# EAGLE design Wattuino-Pro-Mini-PB_v10 (EAGLE 7.5.0)
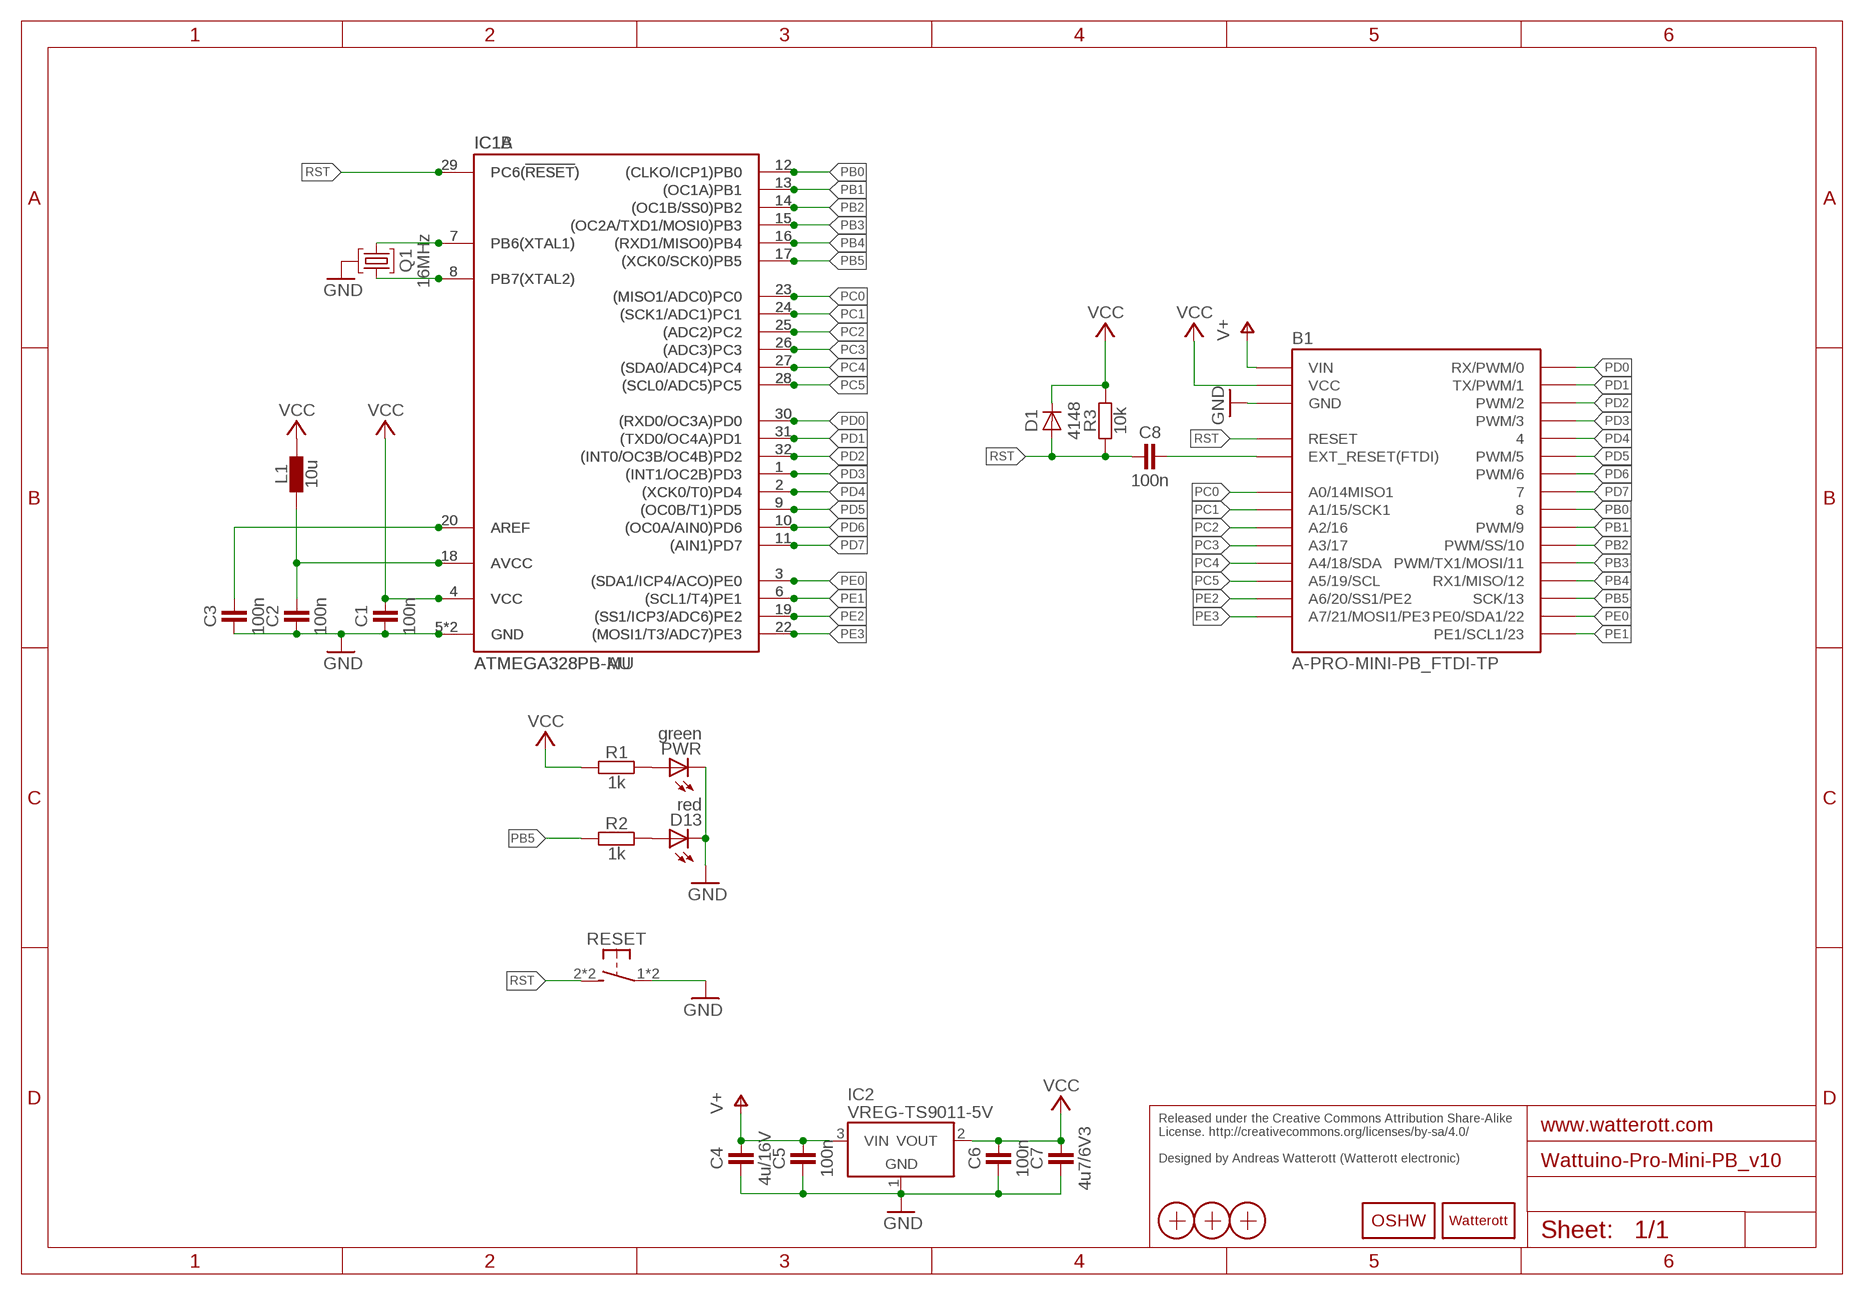
[diagram p0: schematic, sheet 1]

## Parts
B1  A-PRO-MINI-PB_FTDI-TP  [A-PRO-MINI-PB-FTDI_TP]
C1  100n  CAPACITOR-0402  [C0402]
C2  100n  CAPACITOR-0402  [C0402]
C3  100n  CAPACITOR-0402  [C0402]
C4  4u/16V  CAPACITOR-0805  [C0805]
C5  100n  CAPACITOR-0402  [C0402]
C6  100n  CAPACITOR-0402  [C0402]
C7  4u7/6V3  CAPACITOR-0402  [C0402]
C8  100n  CAPACITOR-0402  [C0402]
D1  4148  DIODE-SOD882  [SOD882]
D13  red  LED-0603  [C0603]
IC1A  ATMEGA328PB-AU  [TQFP32]
IC1B  ATMEGA328PB-MU  [QFN32-PAD]
IC2  VREG-TS9011-5V  [SOT23]
L1  10u  INDUCTOR-0603  [C0603]
LOGO1  OSHW_LOGOX0070  [OSHW_6X70]
LOGO2  LOGO-S_PLACE_S  [SPARK_TPLACE_S]
PWR  green  LED-0603  [C0603]
Q1  16MHz  CRYSTAL-RES-32  [CRYSTAL_32X13]
R1  1k  RESISTOR-0402  [C0402]
R2  1k  RESISTOR-0402  [C0402]
R3  10k  RESISTOR-0402  [C0402]
RESET  SW-TACTILE-TL3315  [TL3315N]
X1  PASSER-07  [PASSER_07MM]
X2  PASSER-07  [PASSER_07MM]
X3  PASSER-07  [PASSER_07MM]

## Nets
AREF: C3.2 IC1A.20(AREF) IC1B.20(AREF)
AVCC: C2.2 IC1A.18(AVCC) IC1B.18(AVCC) L1.1
GND: B1.GND@1(GND) B1.GND@2(GND) B1.GND@3(GND) B1.GND@4(GND) C1.1 C2.1 C3.1 C4.1 C5.1 C6.1 C7.1 D13.C IC1A.5(GND) IC1A.21(GND) IC1B.5(GND) IC1B.21(GND) IC2.1(GND) PWR.C Q1.GND RESET.1 RESET.4(P1)
N$3: IC1A.8(PB7(XTAL2)) IC1B.8(PB7(XTAL2)) Q1.1
N$4: IC1A.7(PB6(XTAL1)) IC1B.7(PB6(XTAL1)) Q1.2
N$8: PWR.A R1.2
N$9: D13.A R2.2
N$11: B1.EXT_RST(EXT_RESET(FTDI)) C8.2
PB0: B1.8 IC1A.12((CLKO/ICP1)PB0) IC1B.12((CLKO/ICP1)PB0)
PB1: B1.9(PWM/9) IC1A.13((OC1A)PB1) IC1B.13((OC1A)PB1)
PB2: B1.10(PWM/SS/10) IC1A.14((OC1B/SS0)PB2) IC1B.14((OC1B/SS0)PB2)
PB3: B1.11(PWM/TX1/MOSI/11) IC1A.15((OC2A/TXD1/MOSI0)PB3) IC1B.15((OC2A/TXD1/MOSI0)PB3)
PB4: B1.12(RX1/MISO/12) IC1A.16((RXD1/MISO0)PB4) IC1B.16((RXD1/MISO0)PB4)
PB5: B1.13(SCK/13) IC1A.17((XCK0/SCK0)PB5) IC1B.17((XCK0/SCK0)PB5) R2.1
PC0: B1.A0(A0/14MISO1) IC1A.23((MISO1/ADC0)PC0) IC1B.23((MISO1/ADC0)PC0)
PC1: B1.A1(A1/15/SCK1) IC1A.24((SCK1/ADC1)PC1) IC1B.24((SCK1/ADC1)PC1)
PC2: B1.A2(A2/16) IC1A.25((ADC2)PC2) IC1B.25((ADC2)PC2)
PC3: B1.A3(A3/17) IC1A.26((ADC3)PC3) IC1B.26((ADC3)PC3)
PC4: B1.A4(A4/18/SDA) IC1A.27((SDA0/ADC4)PC4) IC1B.27((SDA0/ADC4)PC4)
PC5: B1.A5(A5/19/SCL) IC1A.28((SCL0/ADC5)PC5) IC1B.28((SCL0/ADC5)PC5)
PD0: B1.RXD@1(RX/PWM/0) B1.RXD@2(RX/PWM/0) IC1A.30((RXD0/OC3A)PD0) IC1B.30((RXD0/OC3A)PD0)
PD1: B1.TXD@1(TX/PWM/1) B1.TXD@2(TX/PWM/1) IC1A.31((TXD0/OC4A)PD1) IC1B.31((TXD0/OC4A)PD1)
PD2: B1.2(PWM/2) IC1A.32((INT0/OC3B/OC4B)PD2) IC1B.32((INT0/OC3B/OC4B)PD2)
PD3: B1.3(PWM/3) IC1A.1((INT1/OC2B)PD3) IC1B.1((INT1/OC2B)PD3)
PD4: B1.4 IC1A.2((XCK0/T0)PD4) IC1B.2((XCK0/T0)PD4)
PD5: B1.5(PWM/5) IC1A.9((OC0B/T1)PD5) IC1B.9((OC0B/T1)PD5)
PD6: B1.6(PWM/6) IC1A.10((OC0A/AIN0)PD6) IC1B.10((OC0A/AIN0)PD6)
PD7: B1.7 IC1A.11((AIN1)PD7) IC1B.11((AIN1)PD7)
PE0: B1.PE0(PE0/SDA1/22) IC1A.3((SDA1/ICP4/ACO)PE0) IC1B.3((SDA1/ICP4/ACO)PE0)
PE1: B1.PE1(PE1/SCL1/23) IC1A.6((SCL1/T4)PE1) IC1B.6((SCL1/T4)PE1)
PE2: B1.A6(A6/20/SS1/PE2) IC1A.19((SS1/ICP3/ADC6)PE2) IC1B.19((SS1/ICP3/ADC6)PE2)
PE3: B1.A7(A7/21/MOSI1/PE3) IC1A.22((MOSI1/T3/ADC7)PE3) IC1B.22((MOSI1/T3/ADC7)PE3)
RST: B1.RST@1(RESET) B1.RST@2(RESET) C8.1 D1.A IC1A.29(PC6(!RESET!)) IC1B.29(PC6(!RESET!)) R3.1 RESET.2(S1) RESET.3(S1)
V+: B1.VIN C4.2 C5.2 IC2.3(VIN)
VCC: B1.VCC@1(VCC) B1.VCC@2(VCC) C1.2 C6.2 C7.2 D1.C IC1A.4(VCC) IC1B.4(VCC) IC2.2(VOUT) L1.2 R1.1 R3.2

## Notes on the sheet
- Released under the Creative Commons Attribution Share-Alike 
  License. http://creativecommons.org/licenses/by-sa/4.0/
  
  Designed by Andreas Watterott (Watterott electronic)

## Library data of the parts
B1 = we-board:A-PRO-MINI-PB_FTDI: Wattuino Pro Mini PB with FTDI connector (Arduino Pro Mini Clone)
C1-C8 = we-rcl:CAPACITOR: Capacitors ...4.7uF @ 6.3V -> 0402 ...10uF @ 16V -> 0603 ...22uF @ 25V -> 0805
D1 = we-rcl:DIODE: Diodes
D13 PWR = we-opto:LED: LEDs red, green, blue -> 0603
IC1A IC1B = we-chip:ATMEGA328PB: Atmel ATmeg328PB AVR Microcontroller
IC2 = we-power:VREG: Voltage Regulators (LDOs, Switching Converters...) LDOs Taiwan Semi TS1117 800mA max 15V - compatible On Semi NCP1117 1A max 20V Taiwan Semi TS9011 250mA max 12V - compatible Diodes AP2210 300mA max 15V - compatible Microchip MCP1702 250mA max 13V - compatible Microchip MCP1703 250mA max 16V - compatible Microchip MCP1754 150mA max 16V Taiwan Semi TS5204 150mA max 16V (low noise) DC/DC Converter Modules Recom R-78Ex.x-1.0-W36 1A max 28V Murata OKI-78SR-x.x/1.5-W36 1.5A max 36V
L1 = we-rcl:INDUCTOR: Inductors Ferrite Bead 0603 1.4A 220Ohm @ 100MH, -> Murata BLM18PG221SH1D 0603 1.0A 20Ohm @ 100MH -> Murata BLM18PG300SN1D
LOGO1 = we-symbol:OSHW_LOGO: Open-Source-Hardware Logo
LOGO2 = we-symbol:LOGO: Watterott electronic Logo
Q1 = we-rcl:CRYSTAL-RES: Crystal Resonators 8MHz and 16MHz -> 32x13
R1-R3 = we-rcl:RESISTOR: Resistors all kinds in 0603 and 0402
RESET = we-switch:SW-TACTILE: Tactile Switches; DIGIKEY: EG4621TR-ND
X1-X3 = we-symbol:PASSER: Fiducial Markers

## Board
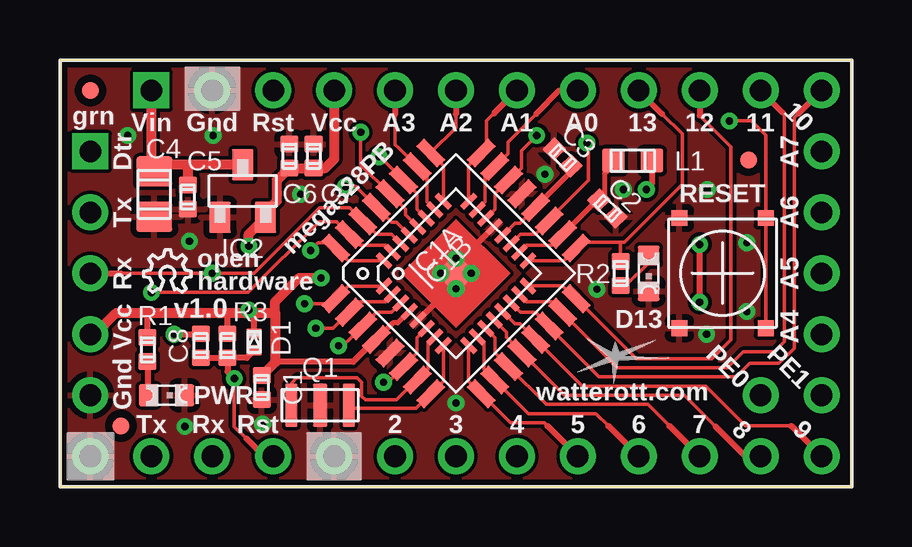
[diagram p1: board, top side]
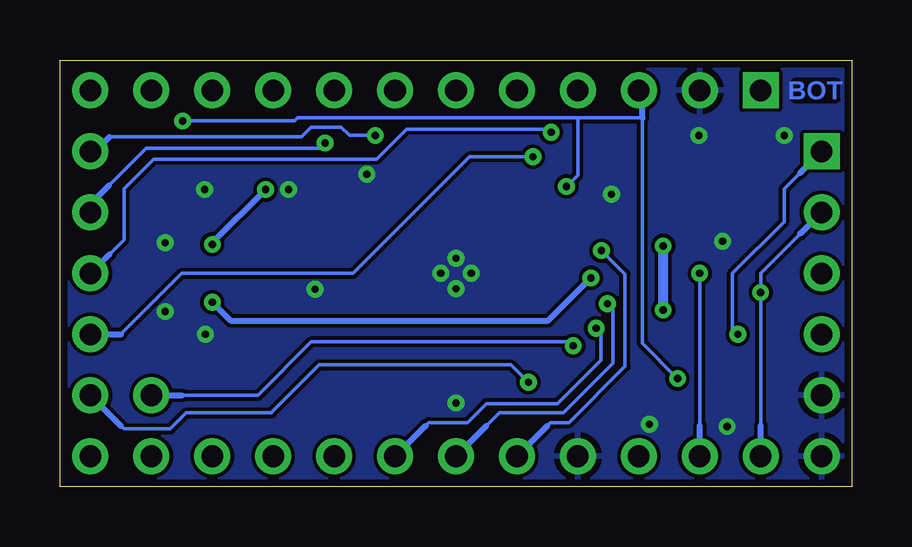
[diagram p2: board, bottom side, seen from below]

Size 33.02 x 17.78 mm. Coordinates in mm from the lower left corner, seen from the top.
Outline: 0,0 33.02,0 33.02,17.78 0,17.78 0,0
Copper layers (1*16): Top 0.035mm / dielectric 1.5mm / Bottom 0.035mm
Design rules "we-dru *": minimum track width 0.15mm, minimum drill 0.3mm, track to track 0.15mm, track to pad 0.15mm, pad to pad 0.15mm, via to via 0.15mm, smd to smd 0.1mm, copper to edge 0.3mm, drill to drill 0.2mm, minimum pad ring 0.18mm, minimum via ring 0.2mm, stop-mask expansion 0.1mm, vias tented up to drill 0.5mm, thermal gap 0.25mm

### Footprints (pad centres in the part's own frame; a part is rotated, then mirrored left to right if it is on the bottom)
A-PRO-MINI-PB-FTDI_TP = drill 0.9 pad 1.5: 2 -2.54,-7.62; 3 0,-7.62; 4 2.54,-7.62; 5 5.08,-7.62; 6 7.62,-7.62; 7 10.16,-7.62; 8 12.7,-7.62; 9 15.24,-7.62; 10 15.24,7.62; 11 12.7,7.62; 12 10.16,7.62; 13 7.62,7.62; A0 5.08,7.62; A1 2.54,7.62; A2 0,7.62; A3 -2.54,7.62; A4 15.24,-2.54; A5 15.24,0; A6 15.24,2.54; A7 15.24,5.08; GND@1 -10.16,7.62; GND@2 -5.08,-7.62; GND@3 -15.24,-7.62; GND@4 -15.24,-5.08; PE0 12.7,-5.08; PE1 15.24,-5.08; RST@1 -7.62,7.62; RST@2 -7.62,-7.62; RXD@1 -10.16,-7.62; RXD@2 -15.24,0; TXD@1 -12.7,-7.62; TXD@2 -15.24,2.54; VCC@1 -5.08,7.62; VCC@2 -15.24,-2.54 | drill 0.9 pad 1.5 square: EXT_RST -15.24,5.08; VIN -12.7,7.62
C0402 = smd 0.75 x 0.7: 1 0,0.5; 2 0,-0.5
C0805 = smd 1.5 x 1.25: 1 0,0.95; 2 0,-0.95
SOD882 = smd 0.65 x 0.4: A 0,-0.35; C 0,0.35
C0603 = smd 0.9 x 0.8: A 0,-0.75; C 0,0.75
TQFP32 = smd 1.27 x 0.5: 1 -4.293,2.8; 2 -4.293,2; 3 -4.293,1.2; 4 -4.293,0.4; 5 -4.293,-0.4; 6 -4.293,-1.2; 7 -4.293,-2; 8 -4.293,-2.8; 17 4.293,-2.8; 18 4.293,-2; 19 4.293,-1.2; 20 4.293,-0.4; 21 4.293,0.4; 22 4.293,1.2; 23 4.293,2; 24 4.293,2.8 | smd 0.5 x 1.27: 9 -2.8,-4.293; 10 -2,-4.293; 11 -1.2,-4.293; 12 -0.4,-4.293; 13 0.4,-4.293; 14 1.2,-4.293; 15 2,-4.293; 16 2.8,-4.293; 25 2.8,4.293; 26 2,4.293; 27 1.2,4.293; 28 0.4,4.293; 29 -0.4,4.293; 30 -1.2,4.293; 31 -2,4.293; 32 -2.8,4.293
QFN32-PAD = smd 0.8 x 0.26: 1 -2.5,1.75; 2 -2.5,1.25; 3 -2.5,0.75; 4 -2.5,0.25; 5 -2.5,-0.25; 6 -2.5,-0.75; 7 -2.5,-1.25; 8 -2.5,-1.75; 17 2.5,-1.75; 18 2.5,-1.25; 19 2.5,-0.75; 20 2.5,-0.25; 21 2.5,0.25; 22 2.5,0.75; 23 2.5,1.25; 24 2.5,1.75 | smd 0.26 x 0.8: 9 -1.75,-2.5; 10 -1.25,-2.5; 11 -0.75,-2.5; 12 -0.25,-2.5; 13 0.25,-2.5; 14 0.75,-2.5; 15 1.25,-2.5; 16 1.75,-2.5; 25 1.75,2.5; 26 1.25,2.5; 27 0.75,2.5; 28 0.25,2.5; 29 -0.25,2.5; 30 -0.75,2.5; 31 -1.25,2.5; 32 -1.75,2.5 | smd 1.2 x 1.2: TP 0,0
SOT23 = smd 1.3 x 0.9: 1 -1.1,0.95; 2 -1.1,-0.95; 3 1.1,0
C0603' = smd 1 x 0.95: 1 0,0.8; 2 0,-0.8
CRYSTAL_32X13 = smd 1.8 x 0.5: 1 0,1.2; 2 0,-1.2 | smd 1.8 x 0.6: GND 0,0
TL3315N = smd 0.65 x 0.7: 1 -2.3,1.8; 2 -2.3,-1.8; 3 2.3,-1.8; 4 2.3,1.8
PASSER_07MM = smd 0.7 x 0.7: X 0,0

### Placement (x,y rotation side)
B1  16.51,8.89 0 top
C1  8.41,4.13 180 top
C2  22.82,11.59 225 top
C3  20.95,13.72 45 top
C4  3.94,12.19 180 top
C5  5.33,12.06 180 top
C6  9.56,13.78 0 top
C7  10.57,13.78 0 top
C8  5.87,5.87 180 top
D1  8.1,6.03 0 top
D13  24.54,8.89 180 top
IC1A  16.51,8.89 45 top
IC1B  16.51,8.89 45 top
IC2  7.62,12.32 90 top
L1  10u  [C0603']  23.88,13.59 90 top
LOGO1  3.49,8.1 0 top
LOGO2  23.18,5.4 0 top
PWR  4.45,3.81 270 top
Q1  10.85,3.4 270 top
R1  3.65,5.71 0 top
R2  23.37,8.89 0 top
R3  6.99,5.87 180 top
RESET  27.62,8.9 90 top
X1  2.54,2.54 0 top
X2  1.27,16.51 0 top
X3  28.7,13.62 0 top

### Tracks (layer width: path | path; a pad name or v marks a point on that pad's centre or on a via)
AREF
  Top 0.15: IC1B.20 18.96,10.99 19.17,10.99 IC1A.20
  Top 0.2: IC1A.20 21.31,13.12 C3.2
AVCC
  Top 0.15: 22.4,11.95 C2.2 | IC1B.18 19.45,10.06 20.51,10.06 IC1A.18
  Top 0.2: IC1A.18 22.4,11.95 | L1.1 23.08,13.42 22.7,13.05 22.7,12.18 C2.2
GND  (via drill 0.3)
  Top 0.254: IC1B.5 15.88,7.9 v15.88,8.89 | IC1B.21 16.8,9.53 v16.51,9.53
  other vias: 5.4,10.22 23.5,12.38 16.51,3.49 20.22,13.02 17.14,8.89 16.51,8.26 26.96,6.35 26.99,12.38 22.38,8.22 10.03,12.19 28.64,10.16 28.64,7.3 6.38,14.64 5.21,2.51 8.45,2.6 2.83,14.64
  pour Top: 0,0 33.02,0 33.02,17.78 0,17.78
  pour Bottom: 0,0 33.02,0 33.02,17.78 0,17.78
N$3
  Top 0.15: IC1B.8 15.98,4.4 IC1A.8 14.85,3.27 12.13,3.27 12.05,3.35 Q1.1
N$4
  Top 0.15: IC1B.7 15.34,5.95 15.34,4.89 IC1A.7 14.85,4.44 14.03,3.62 12.73,3.62 12.57,3.78 12.57,4.35 12.38,4.54 9.87,4.54 9.65,4.32 Q1.2
N$8
  Top 0.2: 3.65,3.85 PWR.A
  Top 0.254: R1.2 3.65,3.85
N$9
  Top 0.15: R2.2 23.6,8.39 24.54,9.34 D13.A
N$11  (via drill 0.3)
  Top 0.15: 5.85,6.35 C8.2
  Top 0.254: v4.76,6.35 5.85,6.35
  Bottom 0.15: v4.76,6.35 4.99,6.57 4.99,8.89 2.83,11.05 2.83,12.41 2.16,13.08
  Bottom 0.254: B1.EXT_RST 2.16,13.08
PB0
  Top 0.15: IC1B.12 18.61,6.44 18.61,6.23 IC1A.12 21.02,3.81 26.04,3.81 27.34,2.51
  Top 0.254: B1.8 28.57,1.27 27.34,2.51
PB1
  Top 0.15: IC1B.13 18.96,6.79 19.17,6.79 IC1A.13 21.77,4.19 26.92,4.19 28.57,2.54 30.48,2.54
  Top 0.254: B1.9 30.48,2.54
PB2
  Top 0.15: IC1B.14 19.19,7.27 19.83,7.27 IC1A.14 20.39,6.66 22.48,4.57 28.19,4.57 28.77,5.14 29.97,5.14 30.61,5.78 30.61,15.37 30.8,15.56
  Top 0.254: B1.10 30.8,15.56
PB3
  Top 0.15: IC1B.15 19.45,7.71 20.51,7.71 IC1A.15 20.96,7.23 23.24,4.95 27.81,4.95 28.48,5.62 29.78,5.62 30.19,6.03 30.19,15.53 30.13,15.59
  Top 0.254: B1.11 30.13,15.59
PB4
  Top 0.15: IC1B.16 19.54,8.38 20.95,8.38 21.5,7.83 IC1A.16 | IC1A.16 21.52,7.81 | 26.67,15.46 27.97,14.16 27.97,6.13 27.18,5.33 24.03,5.33 IC1A.16
  Top 0.254: B1.12 26.67,15.46
PB5
  Top 0.15: 23.37,10.19 21.77,10.19 IC1A.17 21,9.42 IC1B.17 | R2.1 23.37,10.19 | 23.37,10.19 23.53,10.19 25.94,12.61 25.94,14.7 25.11,15.53
  Top 0.254: B1.13 25.11,15.53
PC0
  Top 0.15: IC1B.23 17.72,11.86 17.72,12.93 IC1A.23 18.67,13.88 18.67,14.35 19.84,15.53
  Top 0.254: B1.A0 20.83,16.51 19.84,15.53
PC1
  Top 0.15: IC1B.24 17.04,13.38 IC1A.24 17.78,14.12 17.78,15.24 18.1,15.56
  Top 0.254: B1.A1 18.1,15.56
PC2
  Top 0.15: IC1B.25 15.98,13.38 IC1A.25 16.51,14.96 16.51,15.53
  Top 0.254: B1.A2 16.51,15.53
PC3
  Top 0.15: IC1B.26 15.3,11.86 15.3,12.93 IC1A.26 14.11,14.11 13.97,14.26 13.97,15.53
  Top 0.254: B1.A3 13.97,15.53
PC4  (via drill 0.3)
  Top 0.15: IC1B.27 14.89,11.57 14.89,12.21 IC1A.27 13.35,13.75 v13.3,13.75
  Bottom 0.15: 30.48,6.35 27.94,8.89 20.8,8.89 15.94,13.75 v13.3,13.75
  Bottom 0.254: B1.A4 30.48,6.35
PC5  (via drill 0.3)
  Top 0.15: IC1B.28 14.41,11.34 14.41,11.55 IC1A.28 12.54,13.42 v12.54,14.76
  Bottom 0.15: v12.54,14.76 12.67,14.89 18.57,14.89 19.81,13.65 29.11,13.65 30.35,12.41 30.35,10.29 30.96,9.68
  Bottom 0.254: B1.A5 30.96,9.68
PD0  (via drill 0.3)
  Top 0.15: IC1B.30 13.83,10.51 13.19,10.51 IC1A.30 12.08,11.62 10.83,11.62 8.1,8.89 v6.35,8.89 2.54,8.89
  Top 0.254: B1.RXD@2 2.54,8.89
  Bottom 0.15: 6.35,2.54 v6.35,8.89
  Bottom 0.254: B1.RXD@1 6.35,2.54
PD1  (via drill 0.3)
  Top 0.15: v3.81,8.1 7.84,8.1 10.79,11.05 11.52,11.05 IC1A.31 12.51,10.06 13.57,10.06 IC1B.31
  Bottom 0.15: 2.16,10.54 3.81,8.89 v3.81,8.1 3.81,2.54
  Bottom 0.254: B1.TXD@2 2.16,10.54 | B1.TXD@1 3.81,2.54
PD2  (via drill 0.3)
  Top 0.15: 11.15,10.29 IC1A.32 | IC1B.32 12.02,9.42 IC1A.32 | IC1A.32 11.33,9.95 11.11,10.16 10.76,10.16 v10.45,9.84
  Bottom 0.15: v10.45,9.84 9.46,8.86 9.46,5.02 11.81,2.67 12.57,2.67 12.7,2.54
  Bottom 0.254: B1.2 12.7,2.54
PD3  (via drill 0.3)
  Top 0.15: IC1B.1 12.02,8.36 IC1A.1 11.28,7.62 v10.19,7.62
  Bottom 0.15: v10.19,7.62 9.97,7.4 9.97,5.14 12.03,3.08 14.7,3.08 15.24,2.54
  Bottom 0.254: B1.3 15.24,2.54
PD4  (via drill 0.3)
  Top 0.15: IC1B.2 13.57,7.71 12.51,7.71 IC1A.2 11.4,6.6 v10.67,6.6
  Bottom 0.15: v10.67,6.6 10.48,6.41 10.48,5.27 12.29,3.46 15.24,3.46 16.03,2.67 17.65,2.67 17.78,2.54
  Bottom 0.254: B1.4 17.78,2.54
PD5
  Top 0.15: IC1B.9 17.04,4.4 IC1A.9 18.77,2.67 20.19,2.67 20.32,2.54
  Top 0.254: B1.5 20.32,2.54
PD6
  Top 0.15: IC1B.10 17.68,5.95 17.68,4.89 IC1A.10 19.52,3.05 22.35,3.05 22.86,2.54
  Top 0.254: B1.6 22.86,2.54
PD7
  Top 0.15: IC1B.11 18.13,6.21 18.13,5.57 IC1A.11 20.27,3.43 24.51,3.43 25.4,2.54
  Top 0.254: B1.7 25.4,2.54
PE0  (via drill 0.3)
  Top 0.15: IC1B.3 13.83,7.27 13.19,7.27 IC1A.3 11.8,5.87 v11.62,5.87
  Bottom 0.15: v11.62,5.87 11.78,6.03 22.54,6.03 24.77,3.81 27.94,3.81
  Bottom 0.254: B1.PE0 27.94,3.81
PE1  (via drill 0.3)
  Top 0.15: IC1B.6 14.89,6.21 14.89,5.57 IC1A.6 13.67,4.35 v13.49,4.35
  Bottom 0.15: v13.49,4.35 14.22,5.08 22.23,5.08 24.19,3.11 24.19,3.08 27.75,3.08 28.42,2.41 30.35,2.41 30.48,2.54
  Bottom 0.254: B1.PE1 30.48,2.54
PE2  (via drill 0.3)
  Top 0.15: v21.97,14.32 22.04,14.26 22.04,12.76 20.39,11.12 IC1A.19 19.83,10.51 19.19,10.51 IC1B.19
  Bottom 0.15: v21.97,14.32 22.19,14.1 29.43,14.1 30.99,12.54
  Bottom 0.254: B1.A6 31.75,11.78 30.99,12.54
PE3  (via drill 0.3)
  Top 0.15: IC1B.22 18.13,11.57 18.13,12.21 IC1A.22 18.74,12.77 19.24,13.27 19.24,14 v19.88,14.64
  Bottom 0.15: 30.96,14.57 22.95,14.57 22.54,14.99 21.3,14.99 20.95,14.64 v19.88,14.64
  Bottom 0.254: B1.A7 31.56,13.97 30.96,14.57
RST  (via drill 0.3)
  Top 0.15: RESET.2 RESET.3 29.42,14.65 28.83,15.24 v27.91,15.24 | IC1B.29 14.03,11.02 13.82,11.02 IC1A.29 12.32,12.51 v11.91,12.51 | v7.27,4.51 7.27,2.51 7.78,2 | R3.1
  Top 0.254: C8.1 R3.1 7.79,5.37 D1.A | R3.1 6.99,4.79 v7.27,4.51 | B1.RST@2 8.51,1.27 7.78,2
  Bottom 0.15: 11.43,15.37 23.11,15.37 23.24,15.24 v27.91,15.24 | 11.43,15.37 8.73,15.37 8.73,5.97 v7.27,4.51 | v11.91,12.51 11.43,12.99 11.43,15.37
  Bottom 0.254: 8.73,15.37 8.73,16.35 B1.RST@1
V+
  Top 0.406: B1.VIN 3.81,13.27 C4.2 4.21,13.42 5.33,13.42 | IC2.3 5.33,13.42 | C5.2 5.33,13.42
VCC  (via drill 0.3)
  Top 0.15: IC1A.4 13.12,6.14 13.12,6.11
  Top 0.2: IC1B.4 14.09,6.83 13.88,6.83 IC1A.4 | 8.98,5.21 8.99,5.21
  Top 0.254: L1.2 24.68,12.61 v24.45,12.38 | v26.67,7.68 v26.67,10.1 | 8.99,5.21 12.22,5.21 13.12,6.11 | R1.1 3.65,7.24 | D1.C 8.1,7.24 | R3.2 6.99,7.24
  Top 0.406: C7.2 C6.2 9.05,12.77 9.05,11.91 8.57,11.43 IC2.2 7.87,10.52 v7.87,10.03 | C7.2 | B1.VCC@2 1.46,6.35 2.35,7.24 3.65,7.24 6.99,7.24 8,7.24 | 8,7.24 8.1,7.24 8.98,7.24 | 8,7.24 v7.87,7.37 | v10.89,8.7 9.97,8.7 8.98,7.71 8.98,7.24 | B1.VCC@1 11.43,13.65 11.06,13.28 C7.2 | 8.98,7.24 8.98,5.21 | 8.99,5.21 C1.2
  Bottom 0.15: v26.67,10.1 26.67,10.16
  Bottom 0.254: v26.67,7.68 25.91,6.92 12.67,6.92 v10.89,8.7 | 26.67,10.16 v24.45,12.38
  Bottom 0.406: v7.87,7.37 v7.87,10.03

### Text on the board
Bottom: BOT
tPlace: Vin | Gnd | Rst | Vcc | A3 | A2 | A1 | A0 | 13 | 12 | 11 | 10 | grn | Dtr | A7 | Tx | A6 | open | mega328PB | Rx | hardware | A5 | Vcc | v1.0 | A4 | Gnd | watterott.com | PE0 | PE1 | Tx | Rx | Rst | 2 | 3 | 4 | 5 | 6 | 7 | 8 | 9
Reference: Silkscreen: 21tPlace